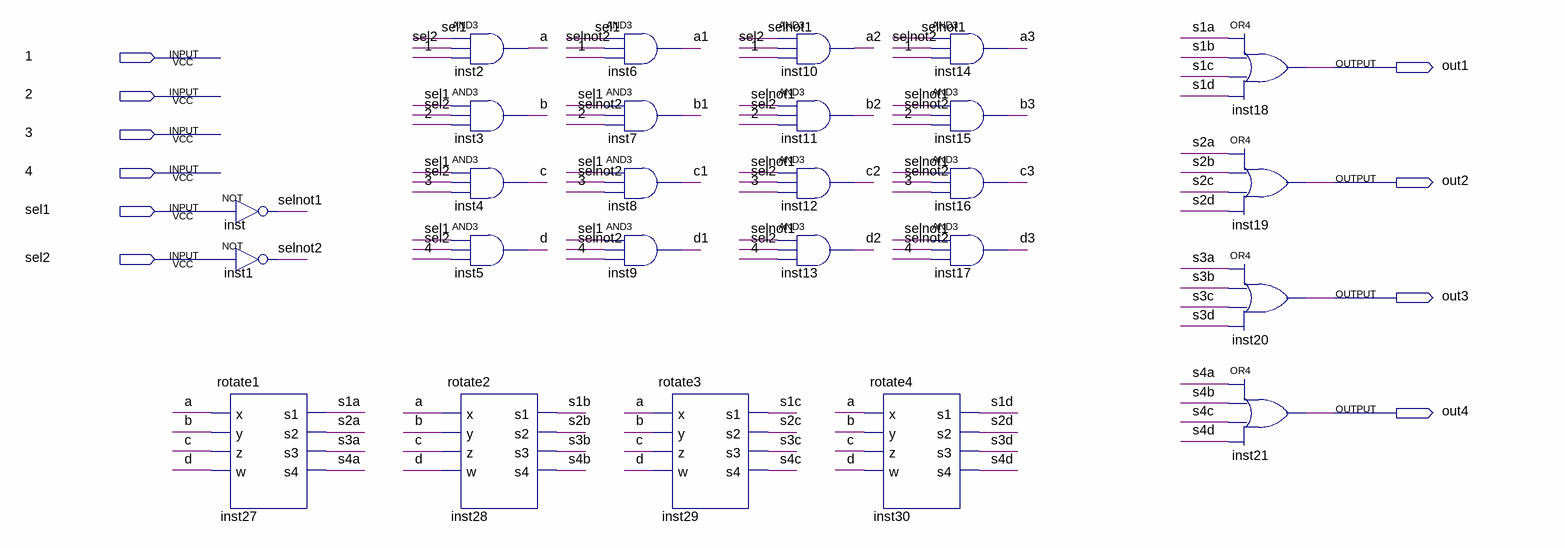
[diagram p0: schematic sheet]
// Quartus schematic rotate.bdf as structural Verilog: 26 symbols, 10 pins
module rotate (
  input  \1 ,
  input  \2 ,
  input  \3 ,
  input  \4 ,
  input  sel1,
  input  sel2,
  output out1,
  output out2,
  output out3,
  output out4
);

  wire a, a1, a2, a3, b, b1, b2, b3, c, c1, c2, c3, d, d1, d2, d3, s1a, s1b, s1c, s1d, s2a, s2b, s2c, s2d,
       s3a, s3b, s3c, s3d, s4a, s4b, s4c, s4d, selnot1, selnot2;

  not inst (selnot1, sel1);
  not inst1 (selnot2, sel2);
  rotate1 inst27 (.x(a), .y(b), .z(c), .w(d), .s1(s1a), .s2(s2a), .s3(s3a), .s4(s4a));
  and inst2 (a, sel1, sel2, \1 );
  and inst3 (b, sel1, sel2, \2 );
  and inst4 (c, sel1, sel2, \3 );
  and inst5 (d, sel1, sel2, \4 );
  rotate2 inst28 (.x(a), .y(b), .z(c), .w(d), .s1(s1b), .s2(s2b), .s3(s3b), .s4(s4b));
  and inst6 (a1, sel1, selnot2, \1 );
  and inst7 (b1, sel1, selnot2, \2 );
  and inst8 (c1, sel1, selnot2, \3 );
  and inst9 (d1, sel1, selnot2, \4 );
  rotate3 inst29 (.x(a), .y(b), .z(c), .w(d), .s1(s1c), .s2(s2c), .s3(s3c), .s4(s4c));
  and inst10 (a2, selnot1, sel2, \1 );
  and inst11 (b2, selnot1, sel2, \2 );
  and inst12 (c2, selnot1, sel2, \3 );
  and inst13 (d2, selnot1, sel2, \4 );
  rotate4 inst30 (.x(a), .y(b), .z(c), .w(d), .s1(s1d), .s2(s2d), .s3(s3d), .s4(s4d));
  and inst14 (a3, selnot1, selnot2, \1 );
  and inst15 (b3, selnot1, selnot2, \2 );
  and inst16 (c3, selnot1, selnot2, \3 );
  and inst17 (d3, selnot1, selnot2, \4 );
  or inst18 (out1, s1a, s1b, s1c, s1d);
  or inst19 (out2, s2a, s2b, s2c, s2d);
  or inst20 (out3, s3a, s3b, s3c, s3d);
  or inst21 (out4, s4a, s4b, s4c, s4d);
endmodule
